# EAGLE design pump_control (EAGLE 7.2.0)
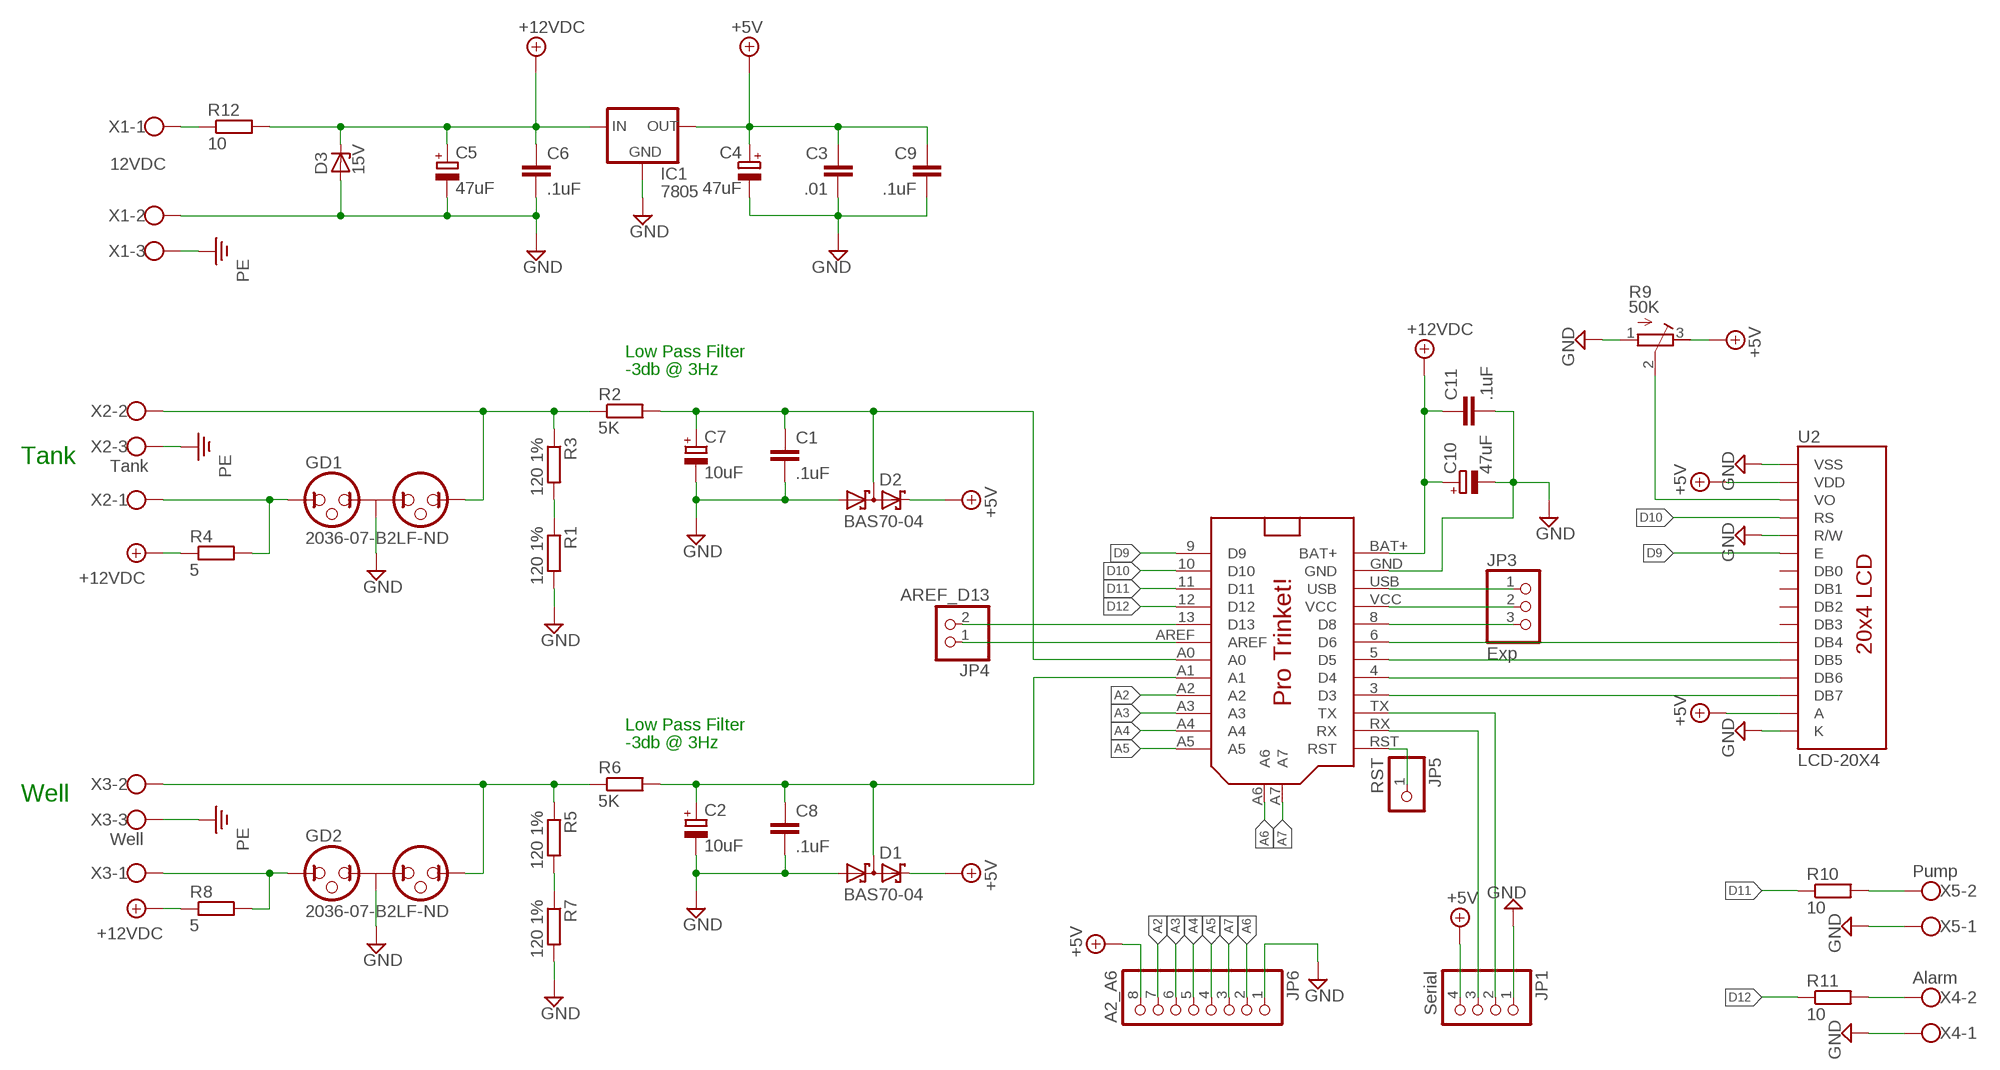
[diagram p0: schematic, sheet 1]

## Parts
C1  .1uF  C-EU050-025X075  [C050-025X075]
C2  10uF  CPOL-EUE3.5-8  [E3,5-8]
C3  .01  C-EU050-025X075  [C050-025X075]
C4  47uF  CPOL-EUE3.5-8  [E3,5-8]
C5  47uF  CPOL-EUE3.5-8  [E3,5-8]
C6  .1uF  C-EU050-025X075  [C050-025X075]
C7  10uF  CPOL-EUE3.5-8  [E3,5-8]
C8  .1uF  C-EU050-025X075  [C050-025X075]
C9  .1uF  C-EU050-025X075  [C050-025X075]
C10  47uF  CPOL-EUE3.5-8  [E3,5-8]
C11  .1uF  C-EU050-025X075  [C050-025X075]
D1  BAS70-04  [SOT23]
D2  BAS70-04  [SOT23]
D3  15V  ZENER-DIODEDO35Z10  [DO35Z10]
GD1  2036-07-B2LF-ND  2036_BOURNS  [2036]
GD2  2036-07-B2LF-ND  2036_BOURNS  [2036]
IC1  7805  78XXS  [78XXS]
JP1  Serial  PINHD-1X4  [1X04]
JP3  Exp  PINHD-1X3  [1X03]
JP4  AREF_D13  PINHD-1X2  [1X02]
JP5  RST  PINHD-1X1  [1X01]
JP6  A2_A6  PINHD-1X8  [1X08]
R1  120 1%  R-EU_0207/10  [0207/10]
R2  5K  R-EU_0207/10  [0207/10]
R3  120 1%  R-EU_0207/10  [0207/10]
R4  5  R-EU_0207/10  [0207/10]
R5  120 1%  R-EU_0207/10  [0207/10]
R6  5K  R-EU_0207/10  [0207/10]
R7  120 1%  R-EU_0207/10  [0207/10]
R8  5  R-EU_0207/10  [0207/10]
R9  50K  R-TRIMM64P  [RTRIM64P]
R10  10  R-EU_0207/10  [0207/10]
R11  10  R-EU_0207/10  [0207/10]
R12  10  R-EU_0207/10  [0207/10]
U1  PRO_TRINKET  [PROTRINKET]
U2  LCD-20X4  [LCD-20X4-TINSHARP]
X1  12VDC  W237-103  [W237-103]
X2  Tank  W237-103  [W237-103]
X3  Well  W237-103  [W237-103]
X4  Alarm  W237-102  [W237-102]
X5  Pump  W237-102  [W237-102]

## Nets
12V_IN: R12.1 X1.1
+5V: C3.1 C4.+ C9.1 D1.2(C2) D2.2(C2) IC1.OUT JP1.4 JP6.8 R9.3(E) U2.2(VDD) U2.15(A)
+12V: C5.+ C6.1 C10.+ C11.1 D3.C IC1.IN R4.1 R8.1 R12.2 U1.BAT+ ; supply symbol labelled +12VDC
A0: C1.1 C7.+ D2.3(C1A2) R2.2 U1.A0
A1: C2.+ C8.1 D1.3(C1A2) R6.2 U1.A1
A2: JP6.7 U1.A2
A3: JP6.6 U1.A3
A4: JP6.5 U1.A4
A5: JP6.4 U1.A5
A6: JP6.2 U1.A6
A7: JP6.3 U1.A7
ALARM+: R11.2 X4.2
AREF: JP4.1 U1.AREF
D3: U1.3(D3) U2.14(DB7)
D4: U1.4(D4) U2.13(DB6)
D5: U1.5(D5) U2.12(DB5)
D6: U1.6(D6) U2.11(DB4)
D8: JP3.3 U1.8(D8)
D9: U1.9(D9) U2.6(E)
D10: U1.10(D10) U2.4(RS)
D11: R10.1 U1.11(D11)
D12: R11.1 U1.12(D12)
D13: JP4.2 U1.13(D13)
GND: C1.2 C2.- C3.2 C4.- C5.- C6.2 C7.- C8.2 C9.2 C10.- C11.2 D1.1(A1) D2.1(A1) D3.A GD1.P$2 GD2.P$2 IC1.GND JP1.1 JP6.1 R1.2 R7.2 R9.1(A) U1.GND U2.1(VSS) U2.5(R/W) U2.16(K) X1.2 X4.1 X5.1
PE: X1.3 X2.3 X3.3
PUMP+: R10.2 X5.2
R3_R1: R1.1 R3.2
R7_R5: R5.2 R7.1
RST: JP5.1 U1.RST
RX: JP1.3 U1.RX
TANK+: GD1.P$1 R4.2 X2.1
TANK-: GD1.P$3 R2.1 R3.1 X2.2
TX: JP1.2 U1.TX
VCC: JP3.2 U1.VCC
VO: R9.2(S) U2.3(VO)
VUSB: JP3.1 U1.USB
WELL+: GD2.P$1 R8.2 X3.1
WELL-: GD2.P$3 R5.1 R6.1 X3.2
Unconnected: U2.7(DB0) U2.8(DB1) U2.9(DB2) U2.10(DB3)

## Notes on the sheet
- Low Pass Filter
- -3db @ 3Hz
- Tank
- Low Pass Filter
- -3db @ 3Hz
- Well

## Library data of the parts
C1 C3 C6 C8 C9 C11 = rcl:C-EU: CAPACITOR, European symbol
C2 C4 C5 C7 C10 = rcl:CPOL-EU: POLARIZED CAPACITOR, European symbol
D1 D2 = diode:BAS70-04: Silicon Schottky Diodes General-purpose diode for high-speed switching
D3 = diode:ZENER-DIODE: Z-Diode
GD1 GD2 = reed6:2036_BOURNS: 2036 Series - Miniature 3-Pole Gas Discharge Tube, BOURNS
IC1 = v-reg:78XXS: VOLTAGE REGULATOR
JP1 = pinhead:PINHD-1X4: PIN HEADER
JP3 = pinhead:PINHD-1X3: PIN HEADER
JP4 = pinhead:PINHD-1X2: PIN HEADER
JP5 = pinhead:PINHD-1X1: PIN HEADER
JP6 = pinhead:PINHD-1X8: PIN HEADER
R1-R8 R10-R12 = rcl:R-EU_: RESISTOR, European symbol
R9 = rcl:R-TRIMM: Trimm resistor
U1 = adafruit:PRO_TRINKET
U2 = SparkFun-Displays:LCD-20X4: Tinsharp, TC2004A-01, 20 x 4 LCD Module
X1-X3 = con-wago-500:W237-103: WAGO SCREW CLAMP; MPN: 237-103; OC_FARNELL: unknown; OC_NEWARK: 18M7116
X4 X5 = con-wago-500:W237-102: WAGO SCREW CLAMP; MPN: 237-102; OC_FARNELL: unknown; OC_NEWARK: 70K9898

## Board
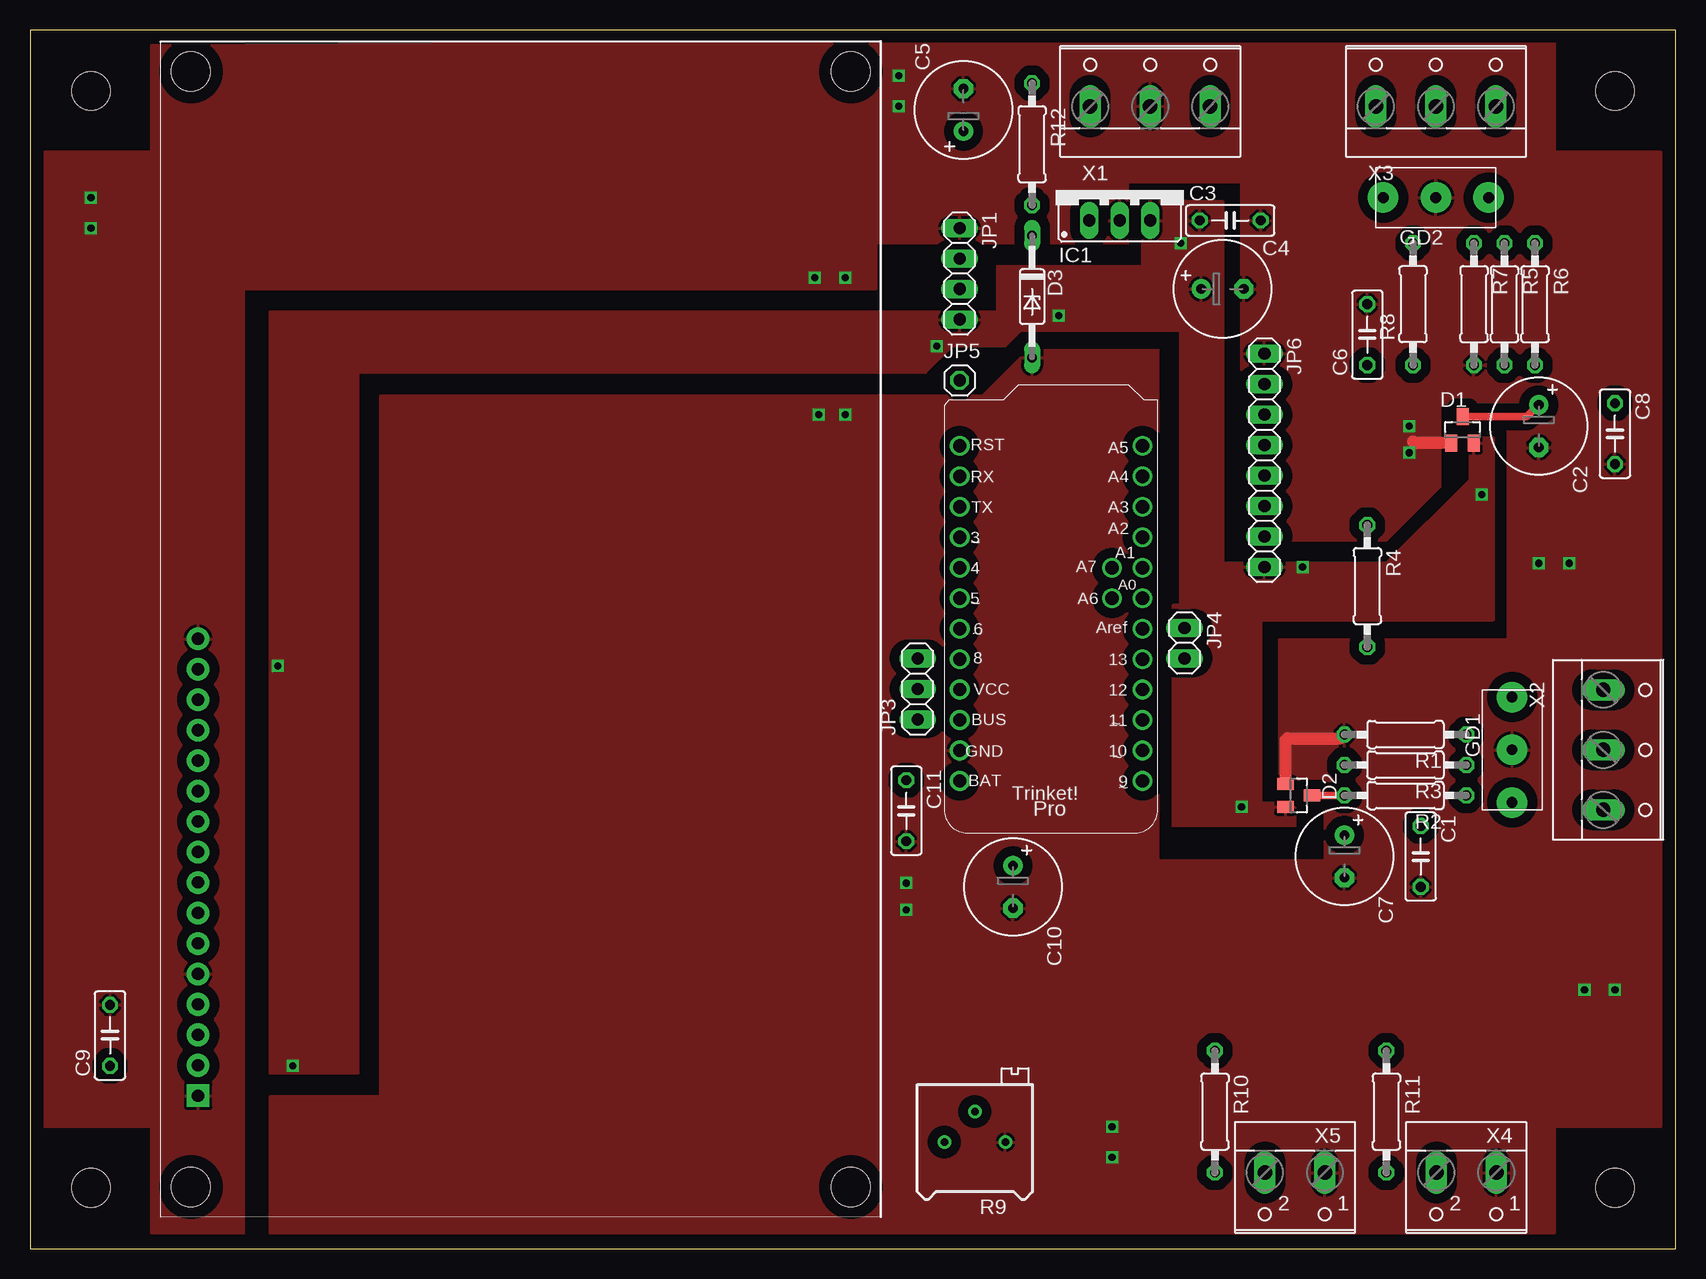
[diagram p1: board, top side]
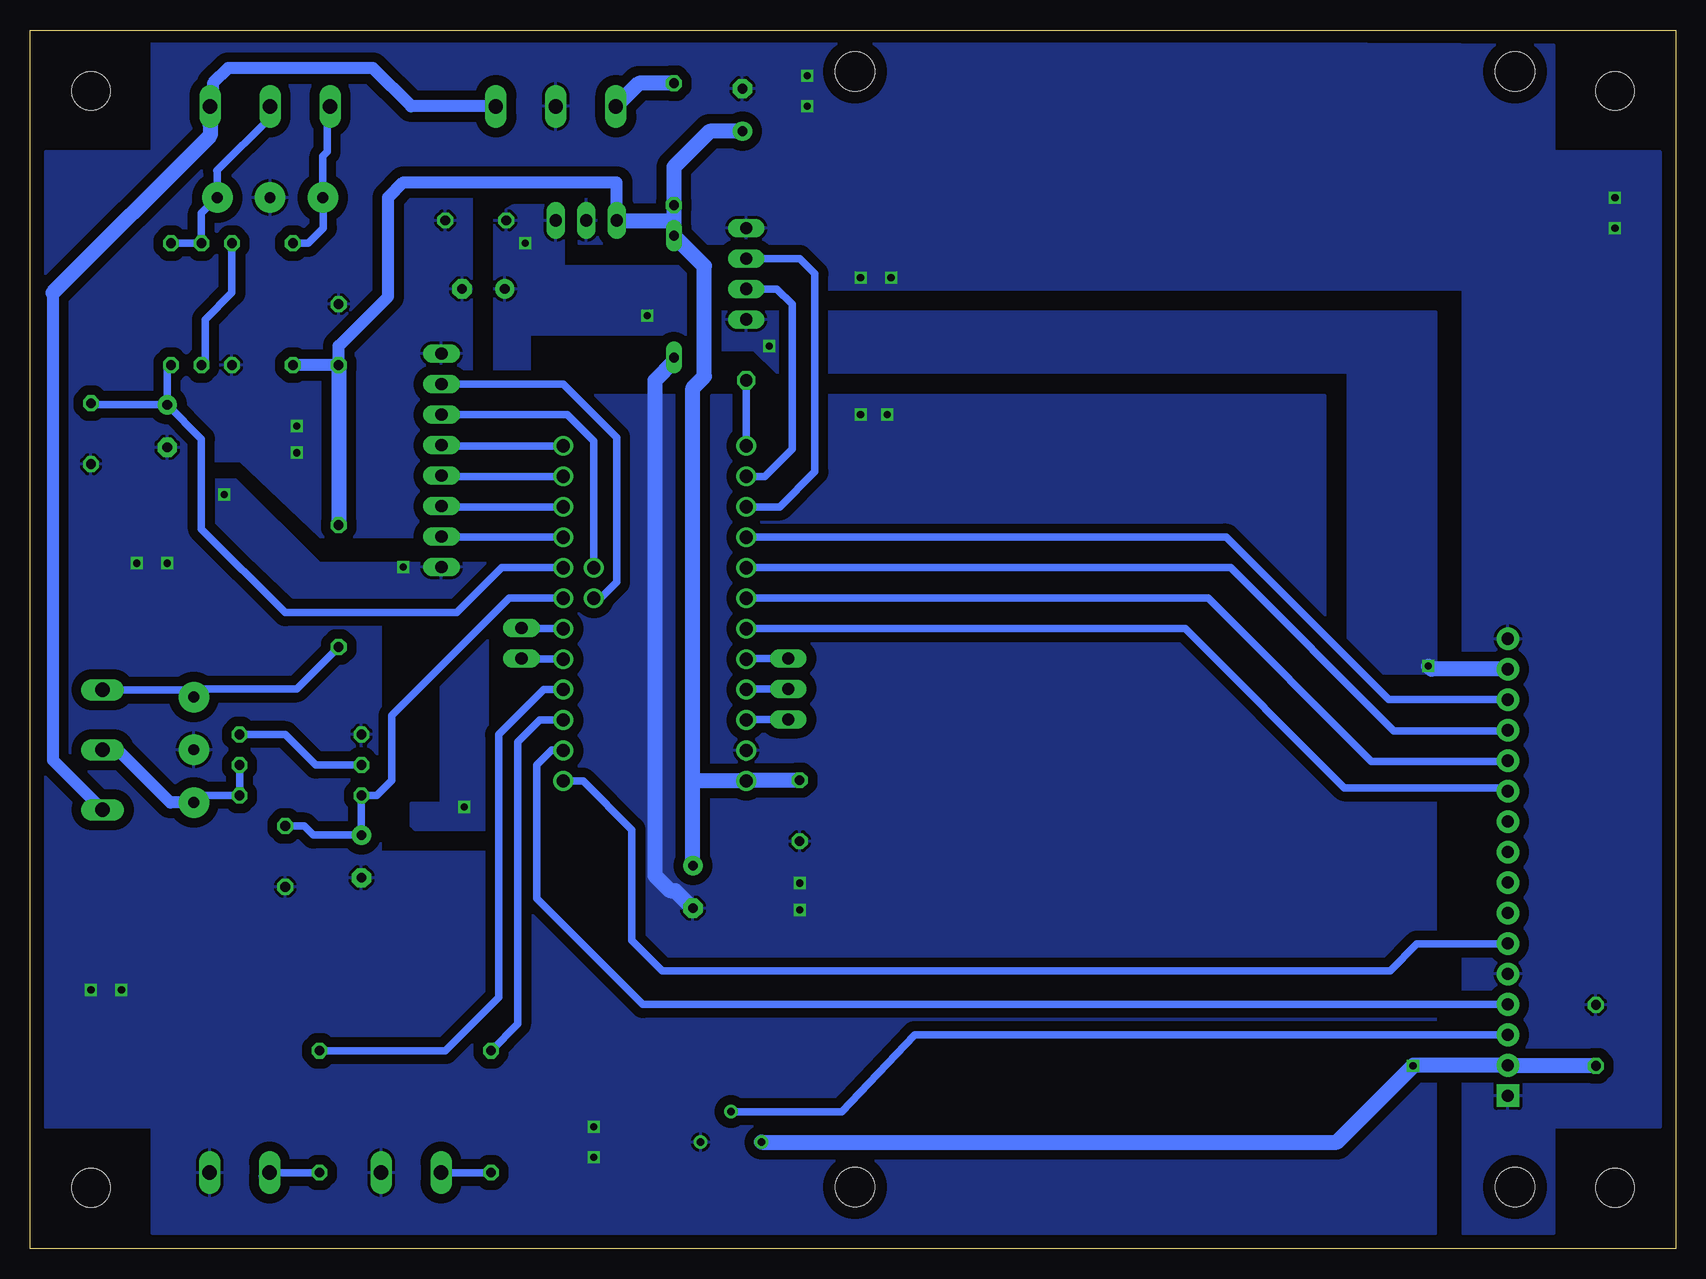
[diagram p2: board, bottom side, seen from below]

Size 137.16 x 101.6 mm. Coordinates in mm from the lower left corner, seen from the top.
Outline: 137.16,0 137.16,101.6 0,101.6 0,0 137.16,0
Copper layers (1*16): Top 0.035mm / dielectric 1.5mm / Bottom 0.035mm
Design rules "default *": minimum track width 10mil, minimum drill 20mil, track to track 8mil, track to pad 8mil, pad to pad 8mil, via to via 8mil, smd to smd 8mil, copper to edge 40mil, drill to drill 8mil, minimum pad ring 10mil, minimum via ring 8mil, stop-mask expansion 4mil, vias tented up to drill 0mil, thermal gap 10mil
Holes 3.2 mm at 5.08,96.52 5.08,5.08 132.08,5.08 132.08,96.52

### Footprints (pad centres in the part's own frame; a part is rotated, then mirrored left to right if it is on the bottom)
C050-025X075 = drill 0.813 octagon: 1 -2.54,0; 2 2.54,0
E3,5-8 = drill 0.813 pad 1.6: + -1.778,0 | drill 0.813 pad 1.6 octagon: - 1.778,0
SOT23 = smd 1 x 1.4: 1 -0.95,-1.1; 2 0.95,-1.1; 3 0,1.1
DO35Z10 = drill 0.813 long: A 5.08,0; C -5.08,0
2036 = drill 0.9 pad 2.54: P$1 -4.394,0; P$2 0,0; P$3 4.394,0
78XXS = drill 1.016 long: GND 0,-2.54; IN -2.54,-2.54; OUT 2.54,-2.54
1X04 = drill 1.016 long: 1 -3.81,0; 2 -1.27,0; 3 1.27,0; 4 3.81,0
1X03 = drill 1.016 long: 1 -2.54,0; 2 0,0; 3 2.54,0
1X02 = drill 1.016 long: 1 -1.27,0; 2 1.27,0
1X01 = drill 1.016 octagon: 1 0,0
1X08 = drill 1.016 long: 1 -8.89,0; 2 -6.35,0; 3 -3.81,0; 4 -1.27,0; 5 1.27,0; 6 3.81,0; 7 6.35,0; 8 8.89,0
0207/10 = drill 0.813 octagon: 1 -5.08,0; 2 5.08,0
RTRIM64P = drill 0.61: 1 0,-2.54; 2 2.54,0; 3 0,2.54
PROTRINKET = drill 1.1: 3 7.62,2.921; 4 7.62,5.461; 5 7.62,8.001; 6 7.62,10.541; 8 7.62,13.081; 9 -7.62,23.241; 10 -7.62,20.701; 11 -7.62,18.161; 12 -7.62,15.621; 13 -7.62,13.081; A0 -7.62,8.001; A1 -7.62,5.461; A2 -7.62,2.921; A3 -7.62,0.381; A4 -7.62,-2.159; A5 -7.62,-4.699; A6 -5.08,8.001; A7 -5.08,5.461; AREF -7.62,10.541; BAT+ 7.62,23.241; GND 7.62,20.701; RST 7.62,-4.699; RX 7.62,-2.159; TX 7.62,0.381; USB 7.62,18.161; VCC 7.62,15.621
LCD-20X4-TINSHARP = drill 1.016 pad 1.88 square: 1 -2.49,2.506 | drill 1.016 pad 1.88: 2 0.05,2.506; 3 2.59,2.506; 4 5.13,2.506; 5 7.67,2.506; 6 10.21,2.506; 7 12.75,2.506; 8 15.29,2.506; 9 17.83,2.506; 10 20.37,2.506; 11 22.91,2.506; 12 25.45,2.506; 13 27.99,2.506; 14 30.53,2.506; 15 33.07,2.506; 16 35.61,2.506 | hole 3.25: -10.09,3.106; -10.09,-51.894; 82.91,3.106; 82.91,-51.894
W237-103 = drill 1.194 long: 1 -5,-1.29; 2 0,-1.29; 3 5,-1.29
W237-102 = drill 1.194 long: 1 -2.5,-1.27; 2 2.5,-1.27

### Placement (x,y rotation side)
C1  115.89,32.7 270 top
C2  125.73,68.58 270 top
C3  100.01,85.72 0 top
C4  99.38,80.01 0 top
C5  77.79,94.93 90 top
C6  111.44,76.2 90 top
C7  109.54,32.7 270 top
C8  132.08,67.94 270 top
C9  6.67,17.78 90 top
C10  81.92,30.16 270 top
C11  73.03,36.51 270 top
D1  119.38,68.26 0 top
D2  105.73,37.78 270 top
D3  83.5,79.38 270 top
GD1  123.51,41.59 270 top
GD2  117.16,87.63 0 top
IC1  90.81,88.27 0 top
JP1  77.47,81.28 270 top
JP3  73.98,46.67 90 top
JP4  96.2,50.48 270 top
JP5  77.47,72.39 0 top
JP6  102.87,65.72 270 top
R1  114.62,42.86 180 top
R2  114.62,37.78 180 top
R3  114.62,40.32 180 top
R4  111.44,55.24 270 top
R5  122.87,78.74 270 top
R6  125.41,78.74 270 top
R7  120.33,78.74 270 top
R8  115.25,78.74 90 top
R9  78.74,8.89 90 top
R10  98.74,11.43 270 top
R11  113.03,11.43 270 top
R12  83.5,92.08 270 top
U1  85.09,62.23 180 top
U2  16.51,15.24 90 top
X1  93.34,96.52 0 top
X2  132.4,41.59 270 top
X3  117.16,96.52 0 top
X4  119.7,5.08 180 top
X5  105.41,5.08 180 top

### Tracks (layer width: path | path; a pad name or v marks a point on that pad's centre or on a via)
12V_IN
  Bottom 1.27: R12.1 86.42,97.16 X1.1
+5V  (via drill 0.6)
  Bottom 1.27: R9.3 28.26,8.89 v21.91,15.24 21.86,15.29 U2.2 13.95,15.24 C9.1 | U2.15 20.37,48.31 v20.64,48.58
  other vias: 75.56,75.25 120.97,62.87 106.05,56.83 95.89,83.82 100.97,36.83 85.72,77.79
  pour Top (isolate 0.813): 20,78.11 80.64,78.11 80.64,81.92 92.71,81.92 92.71,87.31 99.38,87.31 99.38,57.15 113.03,57.15 120.02,64.14 120.02,67.63 121.92,67.63 121.92,52.39 102.55,52.39 102.55,37.15 105.41,37.15 105.41,35.24 95.25,35.24 95.25,53.66 95.89,53.66 95.89,76.52 82.55,76.52 81.28,75.25 76.83,75.25 74.61,73.03 27.3,73.03 27.3,14.61 20,14.61
  pour Bottom (isolate 0.813): 20,47.94 27.3,47.94 27.3,73.03 74.93,73.03 76.83,74.93 81.6,74.93 81.6,75.25 82.55,76.2 95.57,76.2 95.57,53.98 95.89,53.66 98.74,53.66 99.06,53.34 99.06,34.92 105.09,34.92 105.41,35.24 105.41,37.15 102.87,37.15 102.87,54.29 115.25,54.29 121.6,60.33 121.92,64.14 120.02,64.14 113.03,57.15 98.42,57.15 98.42,86.04 96.84,87 93.03,87 92.71,86.68 92.71,81.92 80.64,81.92 80.33,81.6 80.33,78.11 20,78.11
+12V
  Bottom 1.016: IC1.IN 88.27,88.9 106.05,88.9 107.31,87.63 107.31,79.38 111.44,75.25 C6.1 R8.1
  Bottom 1.27: C11.1 77.41,39.05 U1.BAT+ 81.85,38.99 81.92,39.05 | C6.1 R4.1 | 83.5,85.72 R12.2 83.5,90.17 80.52,93.15 C5.+ | 83.5,85.72 D3.C 80.96,81.92 80.96,72.71 81.92,71.75 81.92,39.05 | IC1.IN 83.5,85.72 | C10.+ 81.92,39.05
A0
  Top 0.61: D2.3 R2.2
  Bottom 0.61: C1.1 114.3,35.24 113.54,34.48 C7.+ R2.2 108.27,37.78 107,39.05 107,44.45 97.22,54.23 U1.A0
A1
  Top 0.61: D1.3 124.73,69.36 C2.+
  Bottom 0.61: U1.A1 97.85,56.77 101.6,53.02 115.89,53.02 122.87,60.01 122.87,67.5 C2.+ | 125.54,70.17 C2.+ | C2.+ 125.73,73.34 R6.2 | C2.+ 131.95,70.36 C8.1
A2
  Bottom 0.61: U1.A2 102.87,59.31 JP6.7
A3
  Bottom 0.61: U1.A3 102.87,61.85 JP6.6
A4
  Bottom 0.61: U1.A4 102.87,64.39 JP6.5
A5
  Bottom 0.61: U1.A5 102.87,66.93 JP6.4
A6
  Bottom 0.61: U1.A6 89.6,54.23 88.27,55.56 88.27,67.63 92.71,72.07 JP6.2
A7
  Bottom 0.61: U1.A7 90.17,67.31 92.39,69.53 JP6.3
ALARM+
  Bottom 0.61: R11.2 X4.2 | X4.2 117.47,6.35 117.79,6.03 117.52,6.03 X4.2
AREF
  Bottom 0.61: U1.AREF 96.2,51.69 JP4.1
D3
  Bottom 0.61: U1.3 37.72,59.31 37.47,59.31 23.93,45.77 U2.14
D4
  Bottom 0.61: U1.4 37.08,56.77 23.5,43.18 14.05,43.18 U2.13
D5
  Bottom 0.61: U1.5 38.99,54.23 25.4,40.64 14.05,40.64 U2.12
D6
  Bottom 0.61: U1.6 40.89,51.69 27.62,38.42 14.27,38.42 U2.11
D8
  Bottom 0.61: JP3.3 77.47,49.21 U1.8
D9
  Bottom 0.61: U1.9 91.06,38.99 87,34.92 87,25.72 84.45,23.18 23.81,23.18 21.59,25.4 14.05,25.4 U2.6
D10
  Bottom 0.61: U1.10 92.77,41.59 93.66,41.59 94.93,40.32 94.93,29.21 86.09,20.37 U2.4
D11
  Bottom 0.61: U1.11 94.68,44.07 96.52,42.23 96.52,18.73 R10.1
D12
  Bottom 0.61: U1.12 94.36,46.61 98.11,42.86 98.11,20.95 102.55,16.51 R11.1
D13
  Bottom 0.61: U1.13 96.2,49.15 JP4.2
GND  (via drill 0.6)
  Top 1.016: D2.1 104.63,42.4 104.78,42.55 109.22,42.55 R1.2 | D1.1 115.4,67.16 115.25,67.31
  Bottom 1.27: D3.A 83.5,73.98 85.09,72.39 85.09,31.11 83.82,29.84 83.38,29.84 C10.-
  other vias: 5.08,87.63 5.08,85.09 125.73,57.15 128.27,57.15 132.08,21.59 129.54,21.59 90.17,10.16 90.17,7.62 72.39,97.79 72.39,95.25 67.94,69.53 65.72,69.53 67.94,80.96 65.41,80.96 73.03,30.48 73.03,28.26 114.94,66.36 114.94,68.58
  pour Bottom (isolate 0.813): 1.27,10.16 1.27,91.44 10.16,91.44 10.16,100.33 127,100.97 127,91.44 135.89,91.44 135.89,10.16 127,10.16 127,1.27 20,1.27 20,46.67 29.21,46.67 29.21,71.12 93.98,71.12 93.98,33.02 107.95,33.02 107.95,52.07 117.47,53.34 123.83,59.37 123.83,65.72 119.7,65.72 113.03,59.37 100.33,59.37 100.33,88.9 91.44,88.9 91.44,83.82 78.74,83.82 78.74,80.01 17.78,80.01 17.78,1.27 10.16,1.27 10.16,10.16
  pour Top (isolate 0.813): 1.27,10.16 1.27,91.44 10.16,91.44 10.16,100.33 127,100.97 127,91.44 135.89,91.44 135.89,10.16 127,10.16 127,1.27 20,1.27 20,12.7 29.21,12.7 29.21,71.12 79.38,71.12 83.19,74.93 93.98,74.93 93.98,32.38 107.95,32.38 107.95,39.05 104.14,39.05 104.14,50.8 123.19,50.8 123.19,70.48 117.47,70.48 117.47,63.5 113.03,59.05 100.97,59.05 100.97,88.9 91.44,88.9 91.44,83.82 70.48,83.82 70.48,80.01 17.78,80.01 17.78,1.27 10.16,1.27 10.16,10.16
PE
  Bottom 1.016: X1.3 105.39,95.23 108.58,98.42 120.65,98.42 121.92,97.16 121.92,95.47 X3.3 122.16,93.74 | 135.25,79.69 135.25,40.74 X2.3
  Bottom 1.27: 122.16,93.74 122.16,92.79 135.25,79.69
PUMP+
  Bottom 0.61: R10.2 X5.2
R3_R1
  Bottom 0.61: R3.2 113.35,40.32 115.89,42.86 R1.1
R7_R5
  Bottom 0.61: R7.1 120.33,79.69 122.56,77.47 122.56,73.98 R5.2
RST
  Bottom 0.61: U1.RST JP5.1
RX
  Bottom 0.61: JP1.3 74.93,80.01 73.66,78.74 73.66,66.67 75.95,64.39 U1.RX
TANK+
  Bottom 0.61: R4.2 114.94,46.67 122.82,46.67 GD1.P$1 124.11,46.59 X2.1
TANK-
  Bottom 0.61: R3.1 R2.1 122.92,37.78 GD1.P$3
  Bottom 1.016: GD1.P$3 125.46,37.2 130.18,41.91 131.43,41.91 | 132.08,41.91 131.43,41.91 | 131.43,41.91 X2.2
TX
  Bottom 0.61: U1.TX 74.68,61.85 71.75,64.77 71.75,81.28 73.03,82.55 JP1.2
VCC
  Bottom 0.61: JP3.2 77.47,46.67 U1.VCC
VO
  Bottom 0.61: R9.2 69.53,11.43 63.49,17.79 63.45,17.83 U2.3
VUSB
  Bottom 0.61: JP3.1 77.47,44.13 U1.USB
WELL+
  Bottom 0.61: X3.1 112.39,94.99 112.39,91.44 112.76,91.07 GD2.P$1 112.71,87.58 112.71,85.09 113.98,83.82 R8.2
WELL-
  Bottom 0.61: X3.2 117.16,94.3 121.6,89.85 121.55,89.8 GD2.P$3 122.87,86.31 R5.1 R6.1